# EAGLE design powerpack (EAGLE 7.6.0)
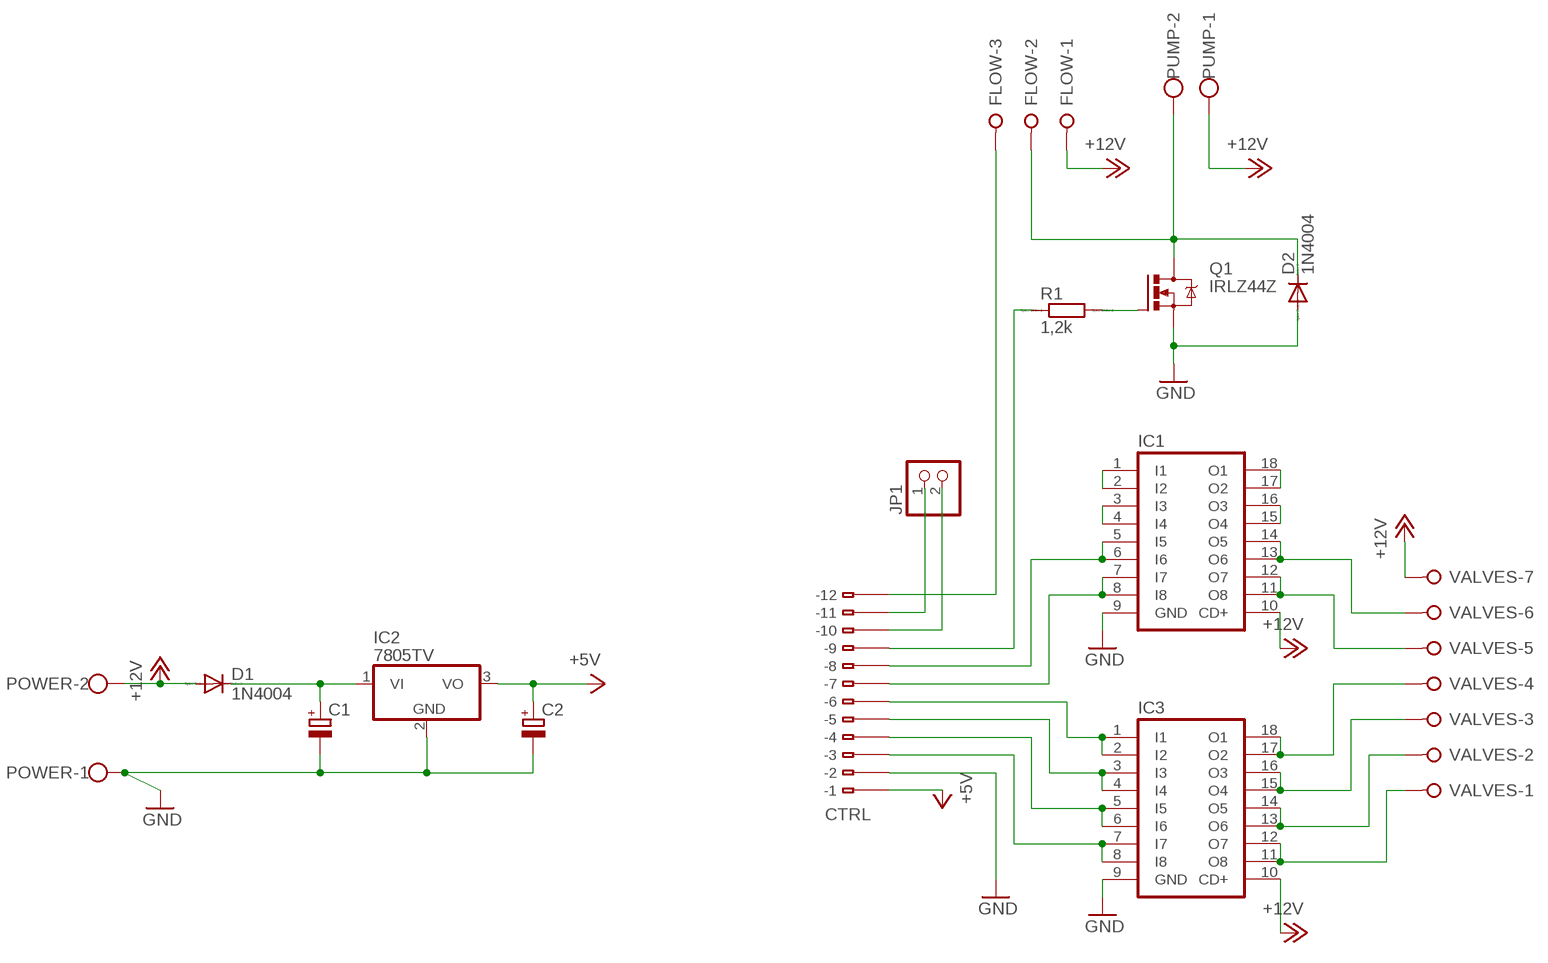
[diagram p0: schematic, sheet 1]

## Parts
C1  CPOL-EUE2.5-7  [E2,5-7]
C2  CPOL-EUE2.5-7  [E2,5-7]
CTRL  233-112  [233-112]
D1  1N4004  [DO41-10]
D2  1N4004  [DO41-10]
FLOW  W237-03P  [W237-133]
IC1  ULN2803A  [DIL18]
IC2  7805TV  [TO220V]
IC3  ULN2803A  [DIL18]
JP1  PINHD-1X2  [1X02]
POWER  W237-102  [W237-102]
PUMP  W237-102  [W237-102]
Q1  IRLZ44Z  [TO220BH]
R1  1,2k  R0207/10  [0207/10]
VALVES  W237-07P  [W237-7P]

## Nets
+5V: C2.+ CTRL.B1(B-1) IC2.3(VO)
+12V: D1.A FLOW.1 IC1.10(CD+) IC3.10(CD+) POWER.2 PUMP.1 VALVES.7
GND: C1.- C2.- CTRL.B2(B-2) D2.A IC1.9(GND) IC2.2(GND) IC3.9(GND) POWER.1 Q1.S
N$1: C1.+ D1.C IC2.1(VI)
N$2: CTRL.B12(B-12) FLOW.3
N$3: CTRL.B11(B-11) JP1.1
N$4: CTRL.B10(B-10) JP1.2
N$6: IC1.1(I1) IC1.2(I2)
N$7: IC1.3(I3) IC1.4(I4)
N$8: CTRL.B8(B-8) IC1.5(I5) IC1.6(I6)
N$9: CTRL.B7(B-7) IC1.7(I7) IC1.8(I8)
N$10: IC1.17(O2) IC1.18(O1)
N$11: IC1.15(O4) IC1.16(O3)
N$12: IC1.13(O6) IC1.14(O5) VALVES.6
N$13: IC1.11(O8) IC1.12(O7) VALVES.5
N$14: Q1.G R1.2
N$15: D2.C FLOW.2 PUMP.2 Q1.D
N$16: IC3.17(O2) IC3.18(O1) VALVES.4
N$18: IC3.15(O4) IC3.16(O3) VALVES.3
N$19: IC3.13(O6) IC3.14(O5) VALVES.2
N$20: IC3.11(O8) IC3.12(O7) VALVES.1
N$21: CTRL.B3(B-3) IC3.7(I7) IC3.8(I8)
N$22: CTRL.B4(B-4) IC3.5(I5) IC3.6(I6)
N$23: CTRL.B5(B-5) IC3.3(I3) IC3.4(I4)
N$24: CTRL.B6(B-6) IC3.1(I1) IC3.2(I2)
N$26: CTRL.B9(B-9) R1.1
Unconnected: CTRL.A1(-1) CTRL.A2(-2) CTRL.A3(-3) CTRL.A4(-4) CTRL.A5(-5) CTRL.A6(-6) CTRL.A7(-7) CTRL.A8(-8) CTRL.A9(-9) CTRL.A10(-10) CTRL.A11(-11) CTRL.A12(-12)

## Library data of the parts
C1 C2 = resistor:CPOL-EU: POLARIZED CAPACITOR, European symbol
CTRL = con-wago:233-112: WAGO Cage Clamp; MPN: 233-112; OC_FARNELL: unknown; OC_NEWARK: 28K9053
D1 D2 = diode:1N4004: DIODE general purpose rectifier, 1 A
FLOW = con-wago-508:W237-03P: WAGO SREW CLAMP; OC_FARNELL: unknown; OC_NEWARK: unknown
IC1 IC3 = uln-udn:ULN2803A: DRIVER ARRAY
IC2 = linear:78*: Positive VOLTAGE REGULATOR Source: http://cache.national.com/ds/LM/LM78L05.pdf http://www.fairchildsemi.com/ds/LM/LM7805.pdf
JP1 = pinhead:PINHD-1X2: PIN HEADER
POWER PUMP = con-wago-500:W237-102: WAGO SCREW CLAMP; MPN: 237-102; OC_FARNELL: unknown; OC_NEWARK: 70K9898
Q1 = transistor-power:IRLZ44Z: N-Channel HEXFET® Power MOSFET Logic Level AUTOMOTIVE MOSFET Source: http://www.irf.com/product-info/datasheets/data/irlz44zpbf.pdf
R1 = eagle-ltspice:R: RESISTOR, European symbol; SPICEMODEL: NONE; SPICEPREFIX: R
VALVES = con-wago-508:W237-07P: WAGO SREW CLAMP; OC_FARNELL: unknown; OC_NEWARK: unknown

## Board
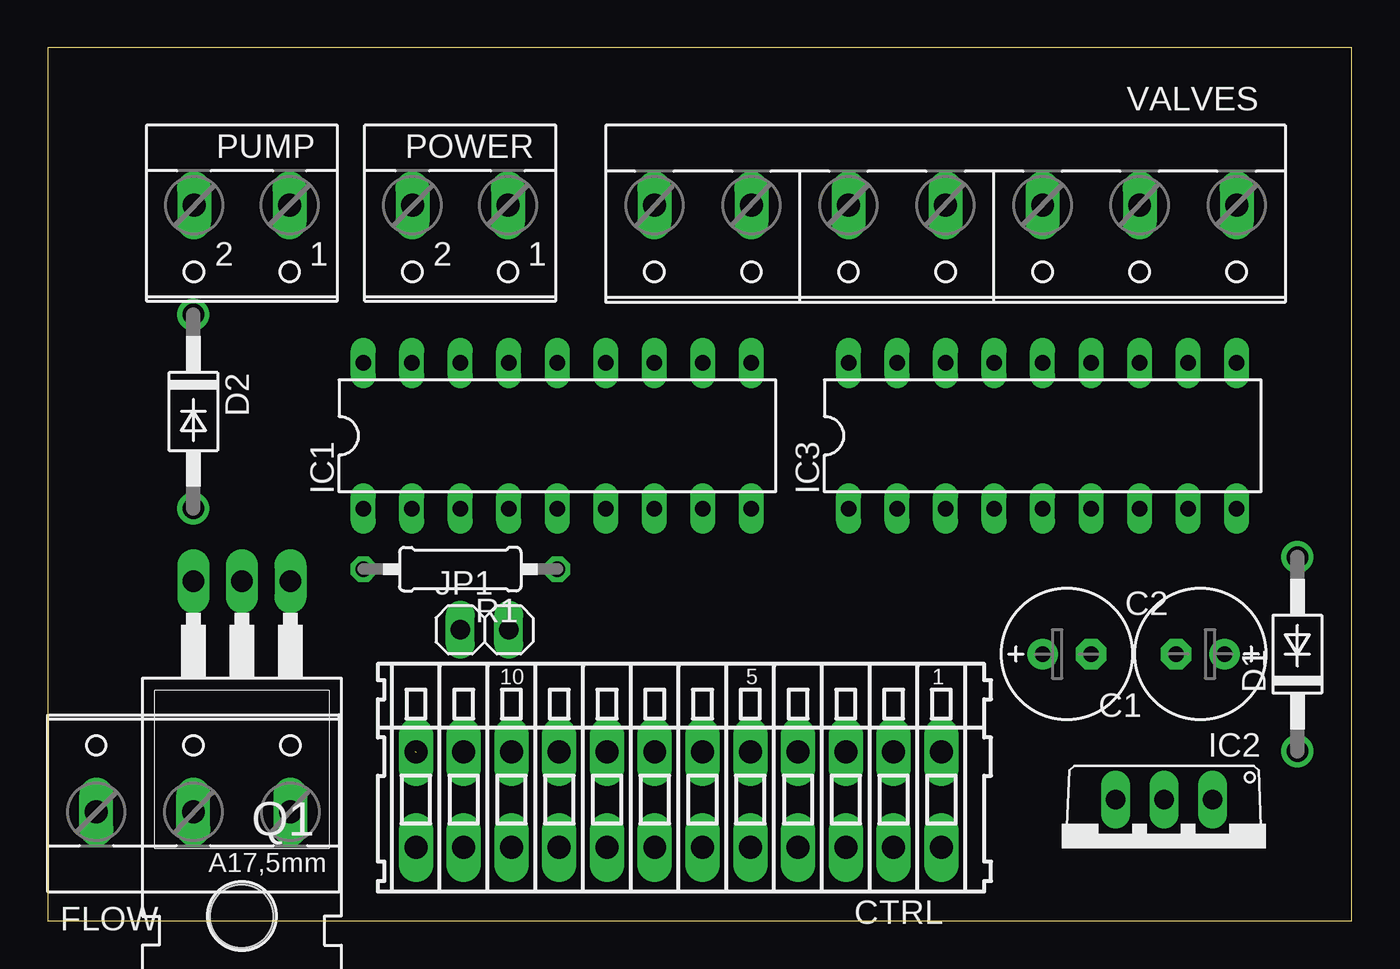
[diagram p1: board, top side]
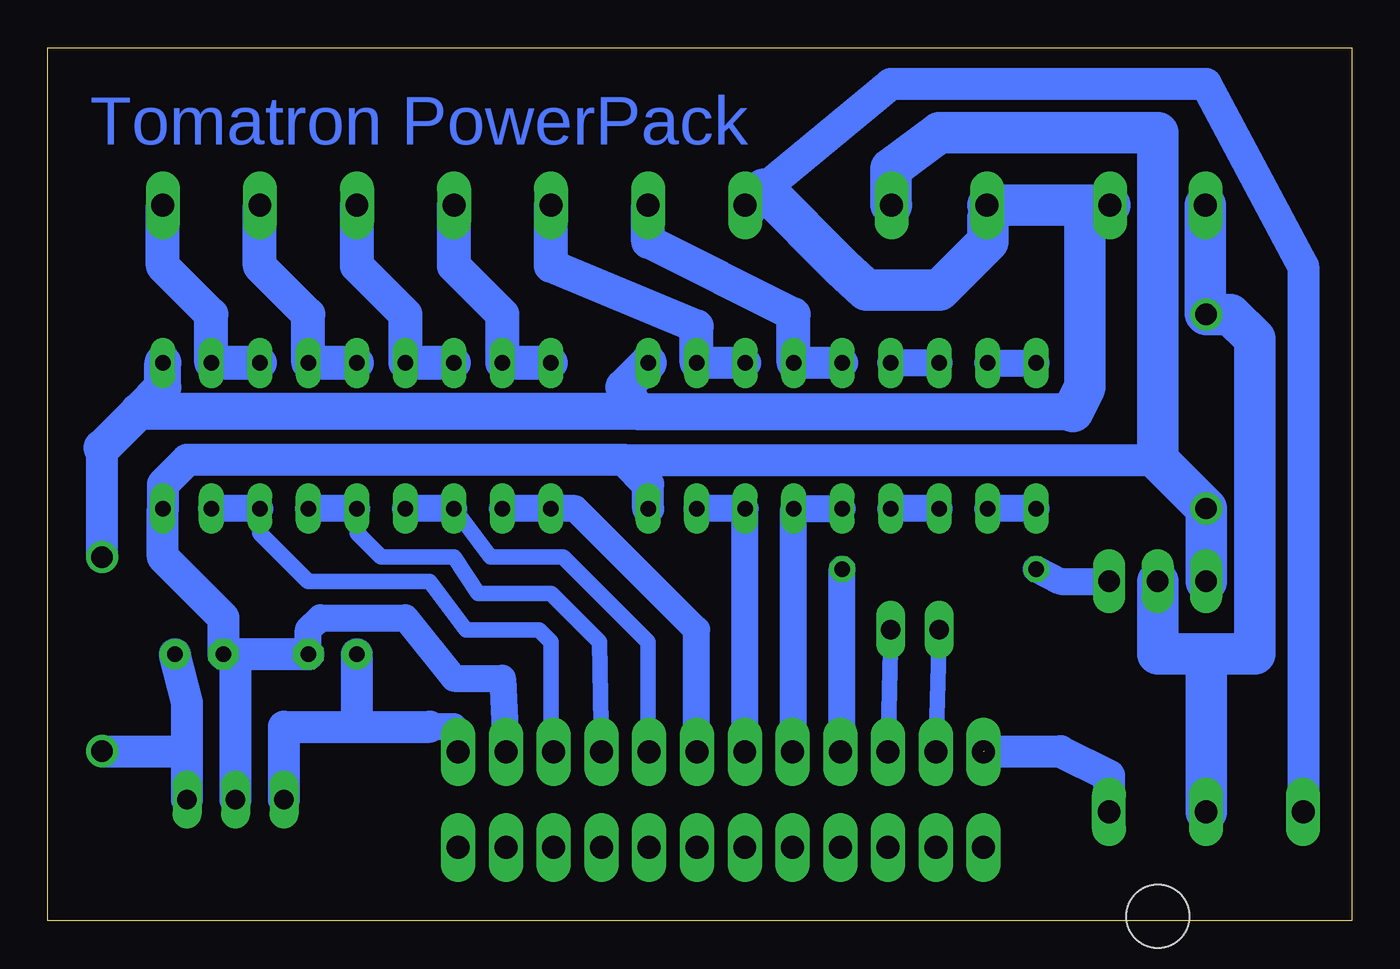
[diagram p2: board, bottom side, seen from below]

Size 68.25 x 45.71 mm. Coordinates in mm from the lower left corner, seen from the top.
Outline: 0,0 68.25,0 68.25,45.71 0,45.71 0,0
Copper layers (1*16): Top 0.035mm / dielectric 1.5mm / Bottom 0.035mm
Design rules "default": minimum track width 10mil, minimum drill 24mil, track to track 8mil, track to pad 8mil, pad to pad 8mil, via to via 8mil, smd to smd 8mil, copper to edge 40mil, drill to drill 8mil, minimum pad ring 10mil, minimum via ring 8mil, stop-mask expansion 4mil, vias tented up to drill 0mil, thermal gap 10mil

### Footprints (pad centres in the part's own frame; a part is rotated, then mirrored left to right if it is on the bottom)
E2,5-7 = drill 0.813 pad 1.6: + -1.27,0 | drill 0.813 pad 1.6 octagon: - 1.27,0
233-112 = drill 1.2 long: A1 -13.75,2.5; A2 -11.25,2.5; A3 -8.75,2.5; A4 -6.25,2.5; A5 -3.75,2.5; A6 -1.25,2.5; A7 1.25,2.5; A8 3.75,2.5; A9 6.25,2.5; A10 8.75,2.5; A11 11.25,2.5; A12 13.75,2.5; B1 -13.75,-2.5; B2 -11.25,-2.5; B3 -8.75,-2.5; B4 -6.25,-2.5; B5 -3.75,-2.5; B6 -1.25,-2.5; B7 1.25,-2.5; B8 3.75,-2.5; B9 6.25,-2.5; B10 8.75,-2.5; B11 11.25,-2.5; B12 13.75,-2.5
DO41-10 = drill 1.118: A 5.08,0; C -5.08,0
W237-133 = drill 1.194 long: 1 -5.08,-0.635; 2 0,-0.635; 3 5.08,-0.635
DIL18 = drill 0.813 long: 1 -10.16,-3.81; 2 -7.62,-3.81; 3 -5.08,-3.81; 4 -2.54,-3.81; 5 0,-3.81; 6 2.54,-3.81; 7 5.08,-3.81; 8 7.62,-3.81; 9 10.16,-3.81; 10 10.16,3.81; 11 7.62,3.81; 12 5.08,3.81; 13 2.54,3.81; 14 0,3.81; 15 -2.54,3.81; 16 -5.08,3.81; 17 -7.62,3.81; 18 -10.16,3.81
TO220V = drill 1.016 long: 1 -2.54,-2.54; 2 0,-2.54; 3 2.54,-2.54
1X02 = drill 1.016 long: 1 -1.27,0; 2 1.27,0
W237-102 = drill 1.194 long: 1 -2.5,-1.27; 2 2.5,-1.27
TO220BH = drill 1.118 long: D 0,-6.35; G -2.54,-6.35; S 2.54,-6.35 | hole 3.302: 0,11.176
0207/10 = drill 0.813 octagon: 1 -5.08,0; 2 5.08,0
W237-7P = drill 1.194 long: 1 -15.24,-0.635; 2 -10.16,-0.635; 3 -5.08,-0.635; 4 0,-0.635; 5 5.08,-0.635; 6 10.16,-0.635; 7 15.24,-0.635

### Placement (x,y rotation side)
C1  60.33,13.97 180 top
C2  53.34,13.97 0 top
CTRL  33.02,6.35 180 top
D1  65.41,13.97 90 top
D2  7.62,26.67 270 top
FLOW  7.62,6.35 0 top
IC1  26.67,25.4 0 top
IC2  58.42,3.81 180 top
IC3  52.07,25.4 0 top
JP1  22.86,15.24 0 top
POWER  21.59,36.2 180 top
PUMP  10.16,36.2 180 top
Q1  10.16,11.43 180 top
R1  21.59,18.41 180 top
VALVES  46.99,36.83 180 top

### Tracks (layer width: path | path; a pad name or v marks a point on that pad's centre or on a via)
+5V
  Bottom 0.406: CTRL.B1 46.99,10.12 46.99,10.16
  Bottom 1.422: 46.99,10.16 48.26,10.16
  Bottom 1.676: IC2.3 55.88,10.16 52.07,10.16 | 52.07,10.16 48.26,10.16 | 52.07,10.16 C2.+
+12V
  Bottom 1.676: VALVES.7 31.75,36.83 30.77,38.3 24.13,43.81 7.62,43.81 2.54,34.29 FLOW.1 | D1.A 65.41,24.77 | POWER.2 19.05,37.47 | 19.05,37.47 19.05,38.1 | 19.05,37.47 19.05,36.83
  Bottom 1.93: IC1.10 38.1,27.94 37.47,26.67 | 37.47,26.67 14.61,26.67 | 37.47,26.67 63.5,26.67 | 63.5,26.67 65.41,24.77 | 63.5,26.67 62.23,27.94 IC3.10
  Bottom 2.184: 19.05,37.47 13.97,37.47 | 13.97,37.47 PUMP.1 | 19.05,36.83 19.05,35.56 21.59,33.02 25.4,33.02 26.67,34.19 30.77,38.3 | 14.61,26.67 13.97,27.94 13.97,37.47
GND
  Bottom 0.406: POWER.1 24.13,37.47 24.13,36.83
  Bottom 1.422: C2.- 54.61,15.24 53.98,15.88 49.53,15.88 46.99,12.7 44.45,12.7 CTRL.B2
  Bottom 1.676: IC1.9 36.83,22.86 38.1,24.13 | 38.1,24.13 60.96,24.13 62.23,22.86 IC3.9 62.23,19.05 59.05,15.88 C1.- 58.42,13.97 | 38.1,24.13 10.16,24.13 | 58.42,13.97 C2.- | IC2.2 58.42,13.97
  Bottom 2.184: Q1.S D2.A 10.16,24.13 10.16,41.27 21.59,41.27 24.13,39.37 24.13,37.51 POWER.1
N$1
  Bottom 1.676: IC2.1 60.96,8.89 | 60.96,8.89 60.96,11.43 C1.+ | D1.C 60.96,8.89
N$2  (1 unrouted)
  Bottom 1.676: 19.23,8.89 15.24,8.89 12.7,7.62 FLOW.3
N$3
  Bottom 0.813: CTRL.B11 JP1.1
N$4
  Bottom 0.813: CTRL.B10 JP1.2
N$6
  Bottom 1.422: IC1.1 IC1.2
N$7
  Bottom 1.422: IC1.3 IC1.4
N$8
  Bottom 0.61: CTRL.B8 29.21,10.12
  Bottom 1.422: 29.21,10.12 IC1.6 IC1.5
N$9
  Bottom 0.61: CTRL.B7 31.75,10.12
  Bottom 1.422: 31.75,10.12 IC1.7 IC1.8
N$10
  Bottom 1.422: IC1.17 IC1.18
N$11
  Bottom 1.422: IC1.16 IC1.15
N$12
  Bottom 1.676: 36.83,36.83 VALVES.6 | IC1.14 IC1.13
  Bottom 1.778: IC1.13 29.21,31.75 36.83,35.56 VALVES.6
N$13
  Bottom 1.676: IC1.12 IC1.11
  Bottom 1.778: IC1.11 34.29,31.11 41.91,34.29 VALVES.5
N$14
  Bottom 1.422: R1.2 15.24,17.78 Q1.G
N$15
  Bottom 2.184: PUMP.2 7.66,31.79 D2.C 6.35,31.75 5.08,30.48 5.08,13.97 7.62,13.97 | 7.62,13.97 10.16,13.97 Q1.D | FLOW.2 7.62,13.97
N$16
  Bottom 1.778: VALVES.4 46.99,34.29 44.45,31.75 IC3.17 IC3.18
N$18
  Bottom 1.778: IC3.16 IC3.15 49.53,31.75 52.07,34.29 VALVES.3
N$19
  Bottom 1.778: IC3.14 IC3.13 54.61,31.75 57.15,34.29 VALVES.2
N$20
  Bottom 1.778: IC3.12 IC3.11 59.69,31.75 62.23,34.29 VALVES.1
N$21
  Bottom 0.61: CTRL.B3 41.91,10.12
  Bottom 0.813: 41.91,10.12 41.91,14.61 42.55,15.24 46.35,15.24 48.26,17.78 54.61,17.78 57.15,20.32 IC3.7
  Bottom 1.422: IC3.7 IC3.8
N$22
  Bottom 0.813: CTRL.B4 39.37,14.61 41.91,17.14 45.72,17.14 46.99,19.05 50.8,19.05 52.07,20.32 IC3.5
  Bottom 1.422: IC3.5 IC3.6
N$23
  Bottom 0.61: CTRL.B5 36.83,10.12
  Bottom 0.813: IC3.3 45.09,19.05 41.27,19.05 36.83,14.61 36.83,10.12
  Bottom 1.422: IC3.3 IC3.4
N$24
  Bottom 0.61: CTRL.B6 34.29,10.12
  Bottom 1.422: 34.29,10.12 34.29,15.24 40.64,21.59 IC3.1 IC3.2
N$26
  Bottom 0.61: CTRL.B9 26.67,10.12
  Bottom 1.422: 26.67,10.12 R1.1

### Text on the board
Bottom: Tomatron PowerPack